# Altium schematic sheet Parallel_Capacitor.SchDoc
size A4
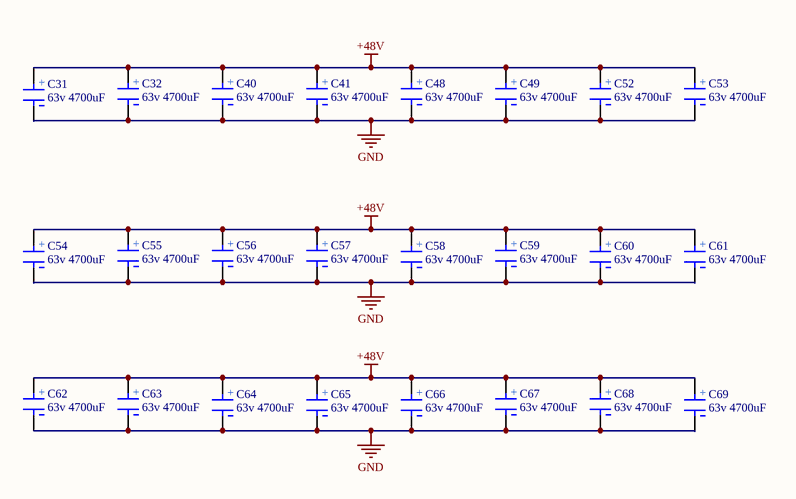
[diagram p0: Parallel_Capacitor.SchDoc]

## Parts
C31  63v 4700uF  [cap 10*20]
C32  63v 4700uF  [cap 10*20]
C40  63v 4700uF  [cap 10*20]
C41  63v 4700uF  [cap 10*20]
C48  63v 4700uF  [cap 10*20]
C49  63v 4700uF  [cap 10*20]
C52  63v 4700uF  [cap 10*20]
C53  63v 4700uF  [cap 10*20]
C54  63v 4700uF  [cap 10*20]
C55  63v 4700uF  [cap 10*20]
C56  63v 4700uF  [cap 10*20]
C57  63v 4700uF  [cap 10*20]
C58  63v 4700uF  [cap 10*20]
C59  63v 4700uF  [cap 10*20]
C60  63v 4700uF  [cap 10*20]
C61  63v 4700uF  [cap 10*20]
C62  63v 4700uF  [cap 10*20]
C63  63v 4700uF  [cap 10*20]
C64  63v 4700uF  [cap 10*20]
C65  63v 4700uF  [cap 10*20]
C66  63v 4700uF  [cap 10*20]
C67  63v 4700uF  [cap 10*20]
C68  63v 4700uF  [cap 10*20]
C69  63v 4700uF  [cap 10*20]

## Nets
+48V: C31.1 C32.1 C40.1 C41.1 C48.1 C49.1 C52.1 C53.1 C54.1 C55.1 C56.1 C57.1 C58.1 C59.1 C60.1 C61.1 C62.1 C63.1 C64.1 C65.1 C66.1 C67.1 C68.1 C69.1
GND: C31.2 C32.2 C40.2 C41.2 C48.2 C49.2 C52.2 C53.2 C54.2 C55.2 C56.2 C57.2 C58.2 C59.2 C60.2 C61.2 C62.2 C63.2 C64.2 C65.2 C66.2 C67.2 C68.2 C69.2

## Notes on the sheet
- (in symbol capacitor 10*20) +

## Library data of the parts
C31 C32 C40 C41 C48 C49 C52-C69 = capacitor 10*20: PKL5-063V472MM450 Aluminum Electrolytic Capacitors - Snap In 63volts 4700uF 20%; Manufacturer: Nichicon; Manufacturer Part Number: LKS1J472MESZ; Capacitance: 4.7mF; Ripple Current: 3A; Life (Hours): 1000Hour; Supplier 1: Mouser; RoHS: Yes; Mount: Through Hole; Case/Package: Radial; Min Operating Temperature: -40°C; Max Operating Temperature: 85°C; Package Quantity: 250; Voltage Rating: 63V; Tolerance: 20%; Packaging: Bulk; Voltage Rating (DC): 63V; Termination: Snap in; Diameter: 22mm; Length: 45mm; Lead Pitch: 0.394inch; Height - Seated (Max): 1.772inch; Supplier Part Number 1: 647-LKS1J472MESZ; ComponentLink2Description: https://www.ozdisan.com/pasif-komponentler/kondansatorler/aluminyum-kondansatorler/PKL5-063V472MM450; ComponentLink2URL: https://www.ozdisan.com/pasif-komponentler/kondansatorler/aluminyum-kondansatorler/PKL5-063V472MM450